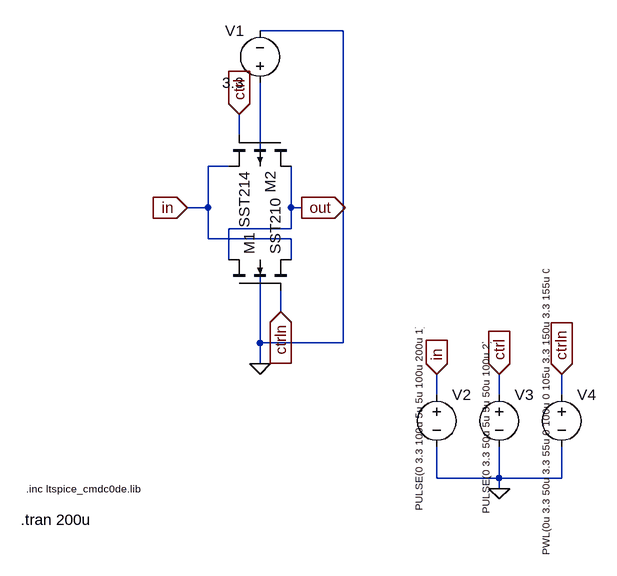
[diagram p0: schematic tg_raw.asc]
tg_raw.asc, the LTspice schematic file:
Version 4.1
SHEET 1 1580 680
WIRE 512 -448 384 -448
WIRE 352 -288 352 -320
WIRE 336 -240 304 -240
WIRE 384 -240 384 -368
WIRE 304 -176 304 -240
WIRE 304 -176 272 -176
WIRE 432 -176 432 -240
WIRE 448 -176 432 -176
WIRE 432 -144 432 -176
WIRE 432 -144 336 -144
WIRE 304 -128 304 -176
WIRE 432 -128 304 -128
WIRE 336 -96 336 -144
WIRE 432 -96 432 -128
WIRE 416 -16 416 -48
WIRE 384 32 384 -96
WIRE 512 32 512 -448
WIRE 512 32 384 32
WIRE 384 64 384 32
WIRE 656 112 656 80
WIRE 752 112 752 80
WIRE 848 112 848 80
WIRE 656 240 656 192
WIRE 752 240 752 192
WIRE 752 240 656 240
WIRE 848 240 848 192
WIRE 848 240 752 240
WIRE 752 256 752 240
FLAG 384 64 0
FLAG 448 -176 out
IOPIN 448 -176 Out
FLAG 272 -176 in
IOPIN 272 -176 In
FLAG 416 -16 ctrln
IOPIN 416 -16 In
FLAG 352 -320 ctrl
IOPIN 352 -320 In
FLAG 752 256 0
FLAG 656 80 in
IOPIN 656 80 In
FLAG 752 80 ctrl
IOPIN 752 80 In
FLAG 848 80 ctrln
IOPIN 848 80 In
SYMBOL nmos4 336 -48 R270
SYMATTR InstName M1
SYMATTR Value SST210
SYMBOL pmos4 432 -288 R90
SYMATTR InstName M2
SYMATTR Value SST214
SYMBOL voltage 384 -352 R180
WINDOW 0 24 96 Left 2
WINDOW 3 24 16 Left 2
WINDOW 123 0 0 Left 0
WINDOW 39 0 0 Left 0
SYMATTR InstName V1
SYMATTR Value 3.3
SYMBOL voltage 656 96 R0
WINDOW 3 -27 195 VLeft 1
WINDOW 123 0 0 Left 0
WINDOW 39 0 0 Left 0
SYMATTR InstName V2
SYMATTR Value PULSE(0 3.3 100u 5u 5u 100u 200u 1)
SYMBOL voltage 752 96 R0
WINDOW 3 -20 199 VLeft 1
WINDOW 123 0 0 Left 0
WINDOW 39 0 0 Left 0
SYMATTR InstName V3
SYMATTR Value PULSE(0 3.3 50u 5u 5u 50u 100u 2)
SYMBOL voltage 848 96 R0
WINDOW 3 -24 263 VLeft 1
WINDOW 123 0 0 Left 0
WINDOW 39 0 0 Left 0
SYMATTR InstName V4
SYMATTR Value PWL(0u 3.3 50u 3.3 55u 0 100u 0 105u 3.3 150u 3.3 155u 0)
TEXT 24 256 Left 1 !.inc ltspice_cmdc0de.lib
TEXT 16 304 Left 2 !.tran 200u

The netlist it stands for:
* tg_raw.asc
M1 out ctrln in 0 SST210
M2 out ctrl in N001 SST214
V1 N001 0 3.3
V2 in 0 PULSE(0 3.3 100u 5u 5u 100u 200u 1)
V3 ctrl 0 PULSE(0 3.3 50u 5u 5u 50u 100u 2)
V4 ctrln 0 PWL(0u 3.3 50u 3.3 55u 0 100u 0 105u 3.3 150u 3.3 155u 0)
.model NMOS NMOS
.model PMOS PMOS
.lib standard.mos
.inc ltspice_cmdc0de.lib
.tran 200u
.backanno
.end